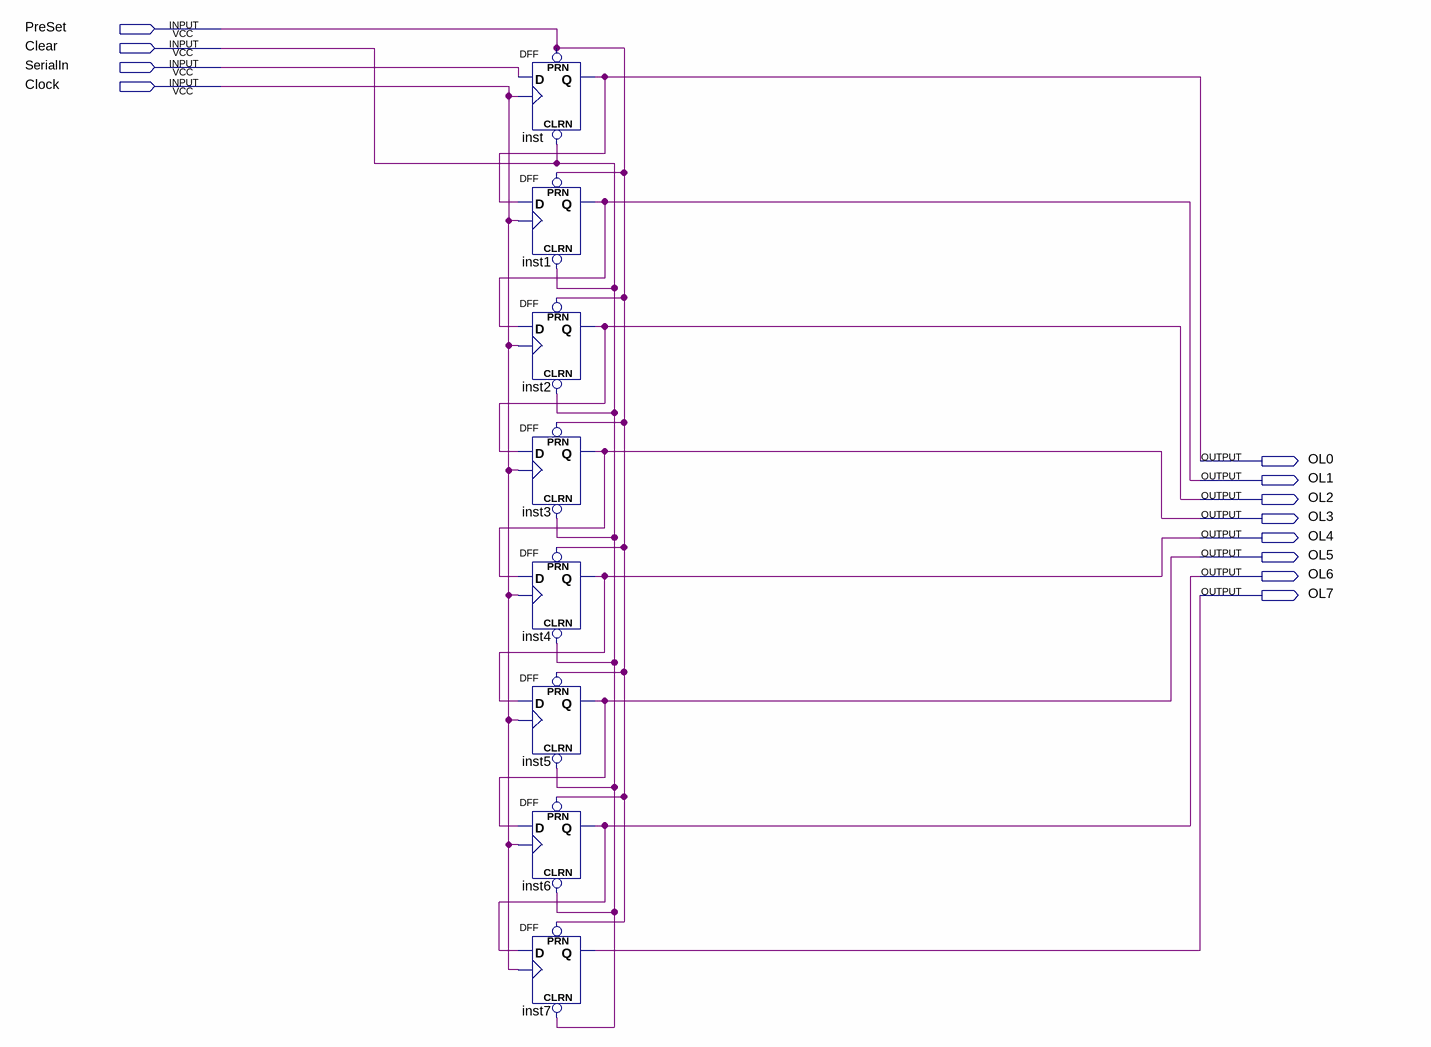
[diagram p0: schematic sheet]
// Quartus schematic SIPO8.bdf as structural Verilog: 8 symbols, 12 pins
module SIPO8 (
  input  PreSet,
  input  Clear,
  input  SerialIn,
  input  Clock,
  output OL0,
  output OL1,
  output OL2,
  output OL3,
  output OL4,
  output OL5,
  output OL6,
  output OL7
);

  DFF inst (.CLRN(Clear), .CLK(Clock), .D(SerialIn), .PRN(PreSet), .Q(OL0));
  DFF inst1 (.CLRN(Clear), .CLK(Clock), .D(OL0), .PRN(PreSet), .Q(OL1));
  DFF inst2 (.CLRN(Clear), .CLK(Clock), .D(OL1), .PRN(PreSet), .Q(OL2));
  DFF inst3 (.CLRN(Clear), .CLK(Clock), .D(OL2), .PRN(PreSet), .Q(OL3));
  DFF inst4 (.CLRN(Clear), .CLK(Clock), .D(OL3), .PRN(PreSet), .Q(OL4));
  DFF inst5 (.CLRN(Clear), .CLK(Clock), .D(OL4), .PRN(PreSet), .Q(OL5));
  DFF inst6 (.CLRN(Clear), .CLK(Clock), .D(OL5), .PRN(PreSet), .Q(OL6));
  DFF inst7 (.CLRN(Clear), .CLK(Clock), .D(OL6), .PRN(PreSet), .Q(OL7));
endmodule
